# EAGLE design main_board (EAGLE 6.4)
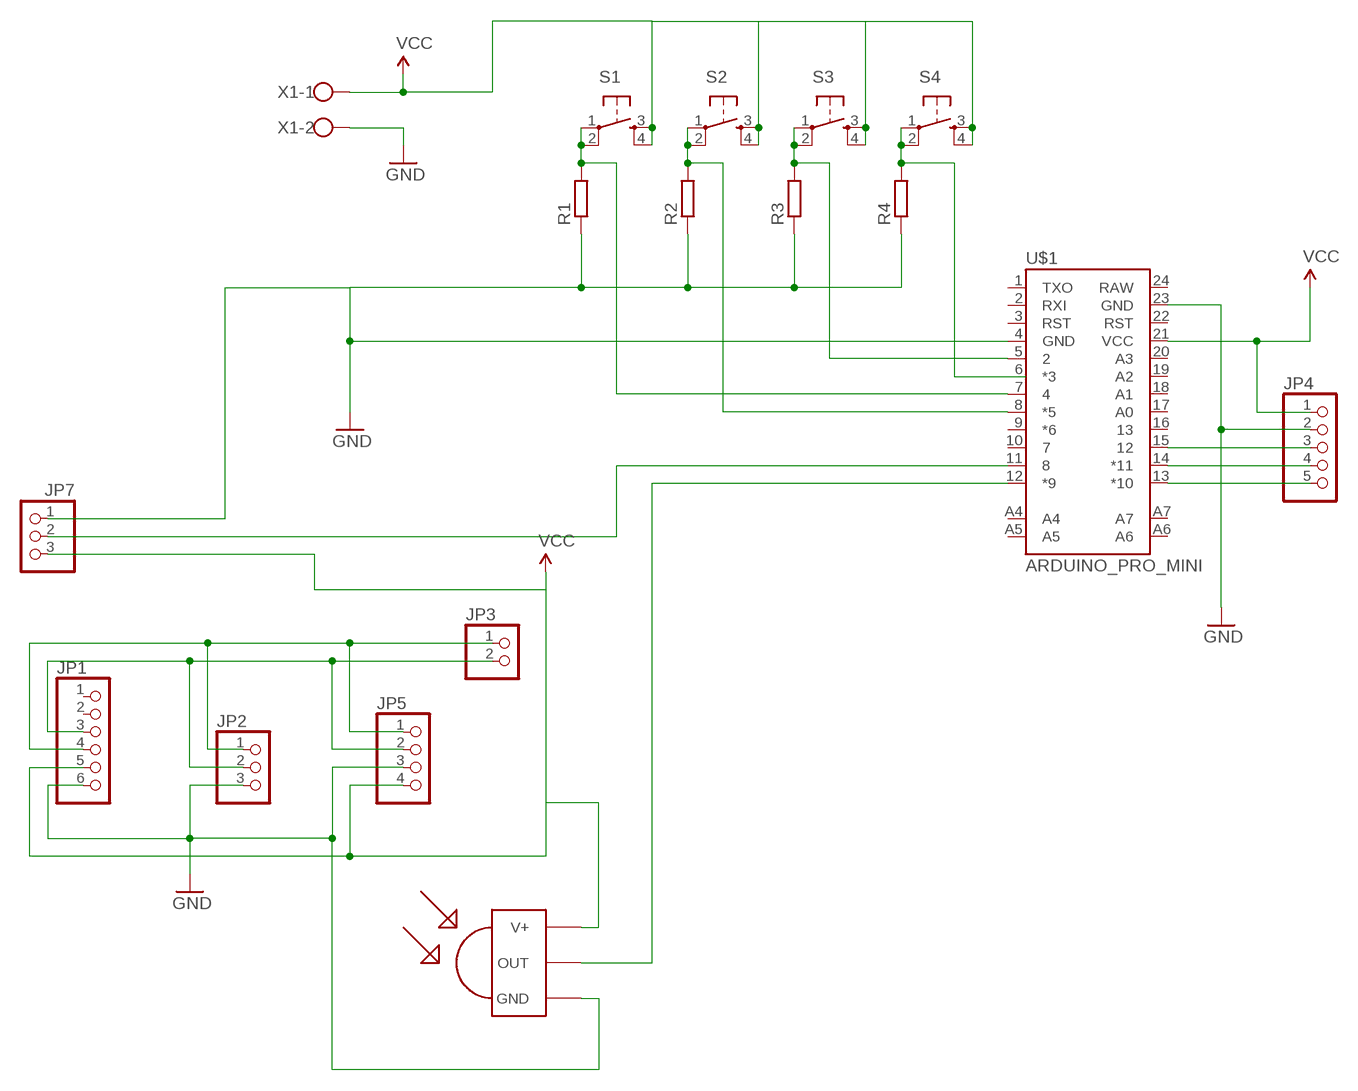
[diagram p0: schematic, sheet 1]

## Parts
JP1  PINHD-1X6  [1X06]
JP2  PINHD-1X3  [1X03]
JP3  PINHD-1X2  [1X02]
JP4  PINHD-1X5  [1X05]
JP5  PINHD-1X4  [1X04]
JP7  PINHD-1X3  [1X03]
R1  R0207/10  [0207/10]
R2  R0207/10  [0207/10]
R3  R0207/10  [0207/10]
R4  R0207/10  [0207/10]
S1  TAC_SWITCHPTH  [TACTILE-PTH]
S2  TAC_SWITCHPTH  [TACTILE-PTH]
S3  TAC_SWITCHPTH  [TACTILE-PTH]
S4  TAC_SWITCHPTH  [TACTILE-PTH]
U$1  ARDUINO_PRO_MINI  [ARDUINO_PRO_MINI]
U$2  TSOP1736  [TSOP17XX]
X1  W237-102  [W237-102]

## Nets
GND: JP1.6 JP2.3 JP4.2 JP5.3 JP7.1 R1.1 R2.1 R3.1 R4.1 U$1.4(GND) U$1.23(GND) U$2.GND X1.2
N$1: JP4.5 U$1.13(*10)
N$2: JP4.4 U$1.14(*11)
N$3: JP4.3 U$1.15
N$4: U$1.12(*9) U$2.OUT
N$6: JP1.4 JP2.1 JP3.1 JP5.1
N$7: JP1.3 JP2.2 JP3.2 JP5.2
N$9: JP7.2 U$1.11
N$10: R3.2 S3.1 S3.2 U$1.5
N$13: R4.2 S4.1 S4.2
N$15: R2.2 S2.1 S2.2 U$1.8(*5)
N$16: R1.2 S1.1 S1.2 U$1.7
VCC: JP1.5 JP4.1 JP5.4 JP7.3 S1.3 S1.4 S2.3 S2.4 S3.3 S3.4 S4.3 S4.4 U$1.21(VCC) U$2.V+ X1.1
Unconnected: JP1.1 JP1.2 U$1.1(TXO) U$1.2(RXI) U$1.3(RST) U$1.6(*3) U$1.9(*6) U$1.10 U$1.16 U$1.17(A0) U$1.18(A1) U$1.19(A2) U$1.20(A3) U$1.22(RST) U$1.24(RAW) U$1.A4 U$1.A5 U$1.A6 U$1.A7

## Library data of the parts
JP1 = pinhead:PINHD-1X6: PIN HEADER
JP2 JP7 = pinhead:PINHD-1X3: PIN HEADER
JP3 = pinhead:PINHD-1X2: PIN HEADER
JP4 = pinhead:PINHD-1X5: PIN HEADER
JP5 = pinhead:PINHD-1X4: PIN HEADER
R1-R4 = eagle-ltspice:R: RESISTOR, European symbol; SPICEMODEL: NONE; SPICEPREFIX: R
S1-S4 = SparkFun-Retired:TAC_SWITCH: Momentary Switch Button commonly used for reset or general input. Spark Fun Electronics SKU : COM-00097 SMT- SWCH-08247
U$1 = SparkFun-Boards:ARDUINO_PRO_MINI
U$2 = tsop:TSOP1736: IR Receiver and Demodulator
X1 = con-wago-500:W237-102: WAGO SCREW CLAMP; MPN: 237-102; OC_FARNELL: unknown; OC_NEWARK: 70K9898

## Board
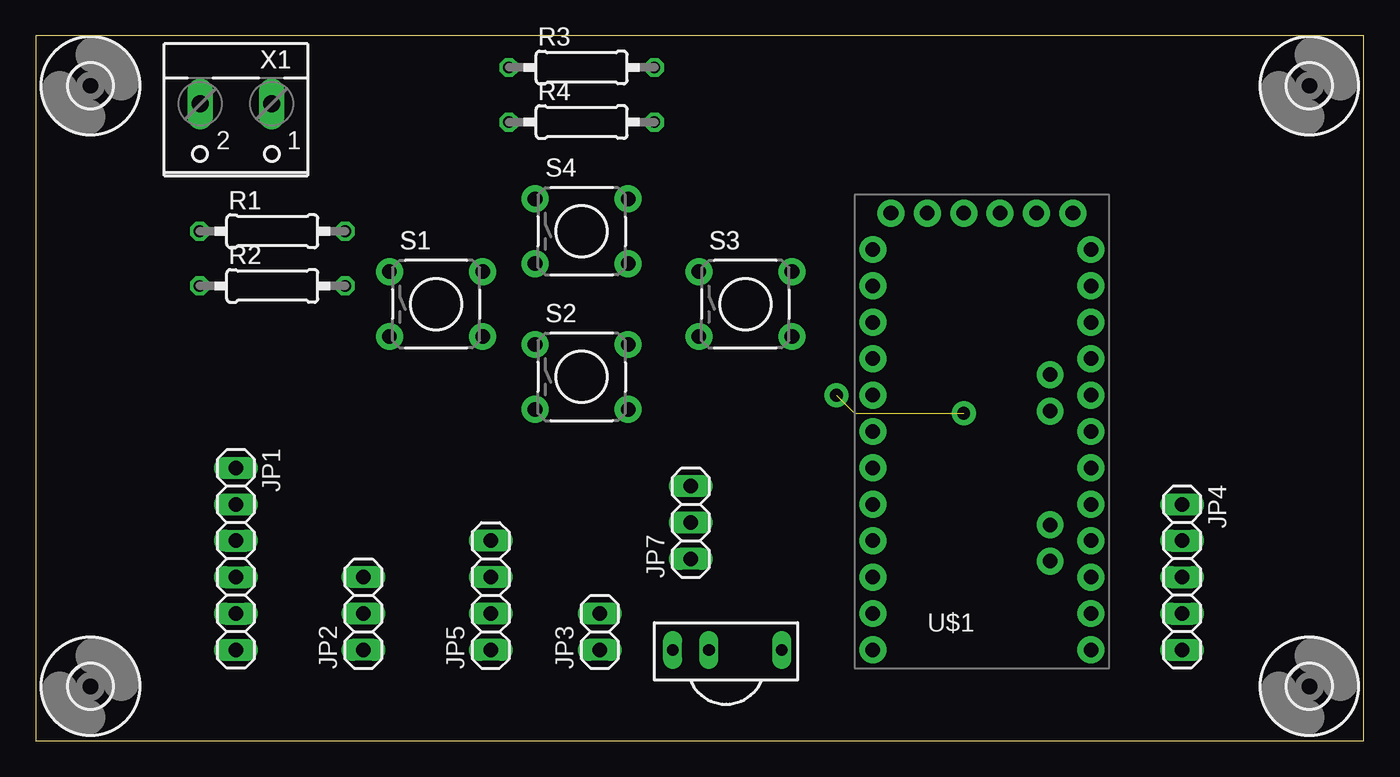
[diagram p1: board, top side]
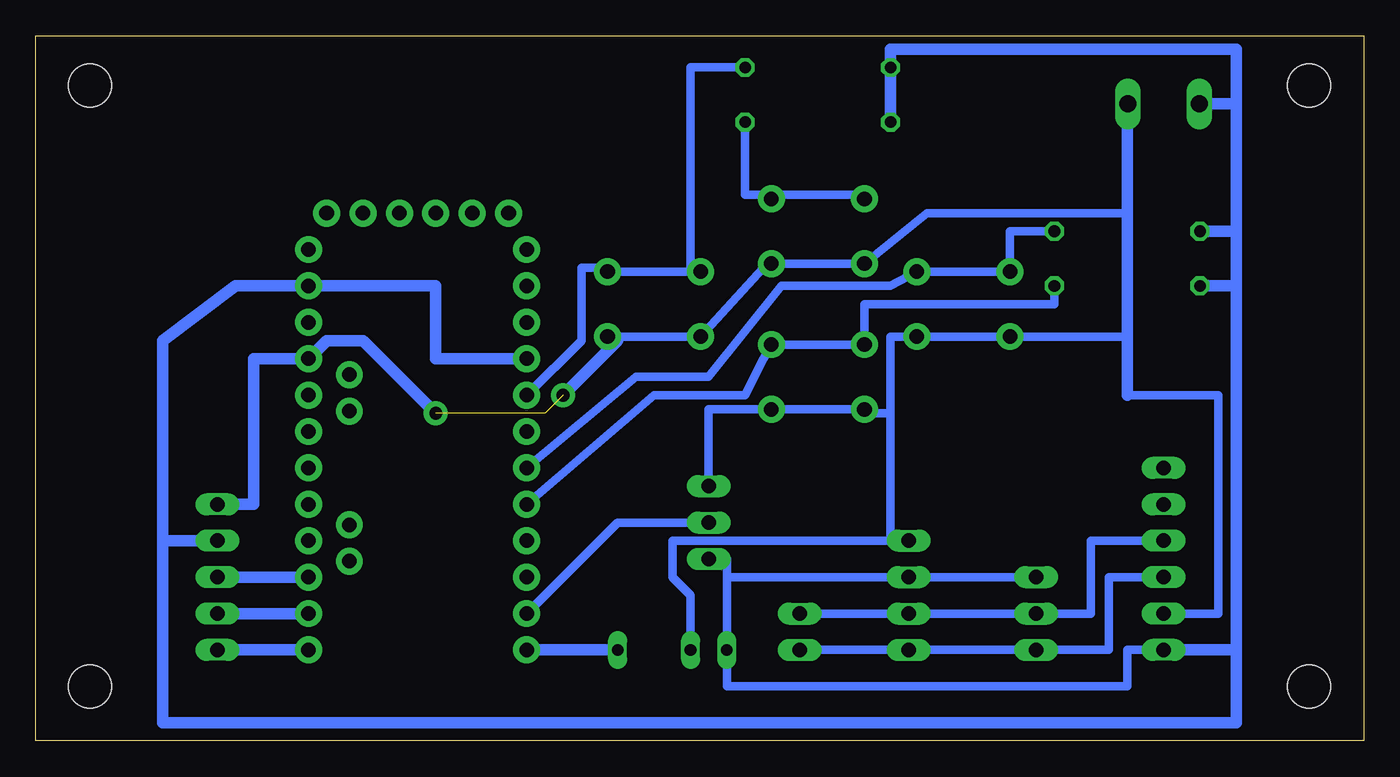
[diagram p2: board, bottom side, seen from below]

Size 92.69 x 49.2 mm. Coordinates in mm from the lower left corner, seen from the top.
Outline: 0,0 92.69,0 92.69,49.2 0,49.2 0,0
Copper layers (1*16): Top 0.035mm / dielectric 1.5mm / Bottom 0.035mm
Design rules "default": minimum track width 10mil, minimum drill 24mil, track to track 8mil, track to pad 8mil, pad to pad 8mil, via to via 8mil, smd to smd 8mil, copper to edge 40mil, drill to drill 8mil, minimum pad ring 10mil, minimum via ring 8mil, stop-mask expansion 4mil, vias tented up to drill 0mil, thermal gap 10mil

### Footprints (pad centres in the part's own frame; a part is rotated, then mirrored left to right if it is on the bottom)
1X06 = drill 1.016 long: 1 -6.35,0; 2 -3.81,0; 3 -1.27,0; 4 1.27,0; 5 3.81,0; 6 6.35,0
1X03 = drill 1.016 long: 1 -2.54,0; 2 0,0; 3 2.54,0
1X02 = drill 1.016 long: 1 -1.27,0; 2 1.27,0
1X05 = drill 1.016 long: 1 -5.08,0; 2 -2.54,0; 3 0,0; 4 2.54,0; 5 5.08,0
1X04 = drill 1.016 long: 1 -3.81,0; 2 -1.27,0; 3 1.27,0; 4 3.81,0
0207/10 = drill 0.813 octagon: 1 -5.08,0; 2 5.08,0
TACTILE-PTH = drill 1.016 pad 1.88: 1 -3.251,2.261; 2 3.251,2.261; 3 -3.251,-2.261; 4 3.251,-2.261
ARDUINO_PRO_MINI = drill 1.016 pad 1.88: 1 -7.62,12.7; 2 -7.62,10.16; 3 -7.62,7.62; 4 -7.62,5.08; 5 -7.62,2.54; 6 -7.62,0; 7 -7.62,-2.54; 8 -7.62,-5.08; 9 -7.62,-7.62; 10 -7.62,-10.16; 11 -7.62,-12.7; 12 -7.62,-15.24; 13 7.62,-15.24; 14 7.62,-12.7; 15 7.62,-10.16; 16 7.62,-7.62; 17 7.62,-5.08; 18 7.62,-2.54; 19 7.62,0; 20 7.62,2.54; 21 7.62,5.08; 22 7.62,7.62; 23 7.62,10.16; 24 7.62,12.7; A4 4.763,1.429; A5 4.763,3.969; A6 4.763,-9.049; A7 4.763,-6.509; BLK -6.35,15.24; GND -3.81,15.24; GRN 6.35,15.24; RXI 1.27,15.24; TXO 3.81,15.24; VCC -1.27,15.24
TSOP17XX = drill 0.813 long: GND -3.81,0; OUT 3.81,0; V+ -1.27,0
3,0 = hole 3: 0,0
W237-102 = drill 1.194 long: 1 -2.5,-1.27; 2 2.5,-1.27

### Placement (x,y rotation side)
JP1  13.97,12.7 270 top
JP2  22.86,8.89 90 top
JP3  39.37,7.62 90 top
JP4  80.01,11.43 270 top
JP5  31.75,10.16 90 top
JP7  45.72,15.24 90 top
R1  16.51,35.56 0 top
R2  16.51,31.75 0 top
R3  38.1,46.99 0 top
R4  38.1,43.18 0 top
S1  27.94,30.48 0 top
S2  38.1,25.4 0 top
S3  49.53,30.48 0 top
S4  38.1,35.56 0 top
U$1  66.04,21.59 0 top
U$2  48.26,6.35 0 top
U$3  [3,0]  3.81,45.72 0 top
U$4  [3,0]  3.81,3.81 0 top
U$5  [3,0]  88.9,45.72 0 top
U$6  [3,0]  88.9,3.81 0 top
X1  13.97,43.18 180 top

### Tracks (layer width: path | path; a pad name or v marks a point on that pad's centre or on a via)
GND
  Bottom 0.61: 44.45,11.43 U$2.GND 44.45,3.81 16.51,3.81 16.51,6.35 JP1.6 | 44.45,11.43 44.45,12.7 JP7.1 | 44.45,11.43 JP5.3 JP2.3
  Bottom 0.813: 8.89,44.45 8.89,35.56 | 8.89,35.56 8.89,31.75 | 8.89,31.75 8.89,6.35 | 8.89,6.35 8.89,1.27 83.82,1.27 83.82,13.97 | 83.82,13.97 JP4.2 | JP1.6 8.89,6.35 | R1.1 8.89,35.56 | R2.1 8.89,31.75 | R4.1 R3.1 33.02,48.26 8.89,48.26 8.89,44.45 | X1.2 8.89,44.45 | U$1.4 64.77,26.67 64.77,31.75 U$1.23 78.74,31.75 83.82,27.94 83.82,13.97
N$1
  Bottom 0.813: JP4.5 U$1.13
N$2
  Bottom 0.813: JP4.4 U$1.14
N$3
  Bottom 0.813: U$1.15 JP4.3
N$4
  Bottom 0.813: U$1.12 U$2.OUT
N$6
  Bottom 0.61: JP3.1 JP5.1 JP2.1 17.78,6.35 17.78,11.43 JP1.4
N$7
  Bottom 0.61: JP3.2 JP5.2 JP2.2 19.05,8.89 19.05,13.97 JP1.3
N$9
  Bottom 0.61: JP7.2 52.07,15.24 U$1.11
N$10
  Bottom 0.61: S3.1 46.99,32.74 | 46.99,32.74 S3.2 53.34,33.02 54.61,33.02 54.61,27.94 U$1.5 | R3.2 46.99,46.99 46.99,32.74
N$13
  Bottom 0.61: R4.2 43.18,38.1 41.35,38.1 | 41.35,38.1 S4.2 | 41.35,38.1 34.85,38.1 S4.1
N$15
  Bottom 0.61: R2.2 21.59,30.48 34.85,30.48 S2.1 S2.2 41.91,26.67 43.18,24.13 49.53,24.13 U$1.8
N$16
  Bottom 0.61: R1.2 24.69,35.56 S1.1 S1.2 33.02,31.75 40.64,31.75 45.72,25.4 50.8,25.4 U$1.7
VCC  (via drill 0.9 pad 1.68)  (2 unrouted)
  Bottom 0.254: 52.07,27.94 S3.4
  Bottom 0.61: S3.4 S3.3 41.91,33.02 S4.4 S4.3 30.48,36.83 16.51,36.83 | 16.51,27.94 16.51,28.22 S1.3 S1.4 33.02,28.22 33.02,22.86 | 33.02,22.86 34.85,22.86 S2.3 S2.4 45.72,23.14 JP7.3 | JP5.4 33.02,13.97 | 33.02,13.97 33.02,22.86 | 16.51,24.13 10.16,24.13 10.16,8.89 JP1.5 | U$2.V+ 46.99,10.16 48.26,11.43 48.26,13.97 33.02,13.97
  Bottom 0.813: JP4.1 77.47,16.51 77.47,26.67 U$1.21 72.39,27.94 69.85,27.94 v64.77,22.86 | X1.1 16.51,44.45 16.51,36.83 16.51,27.94 16.51,24.13 | 52.07,27.94 v55.88,24.13

### Text on the board
_tsilk: X1 | R3 | R4 | S4 | R1 | S1 | S3 | R2 | S2